# EAGLE design CORS_Front_Panel (EAGLE 9.6.2)
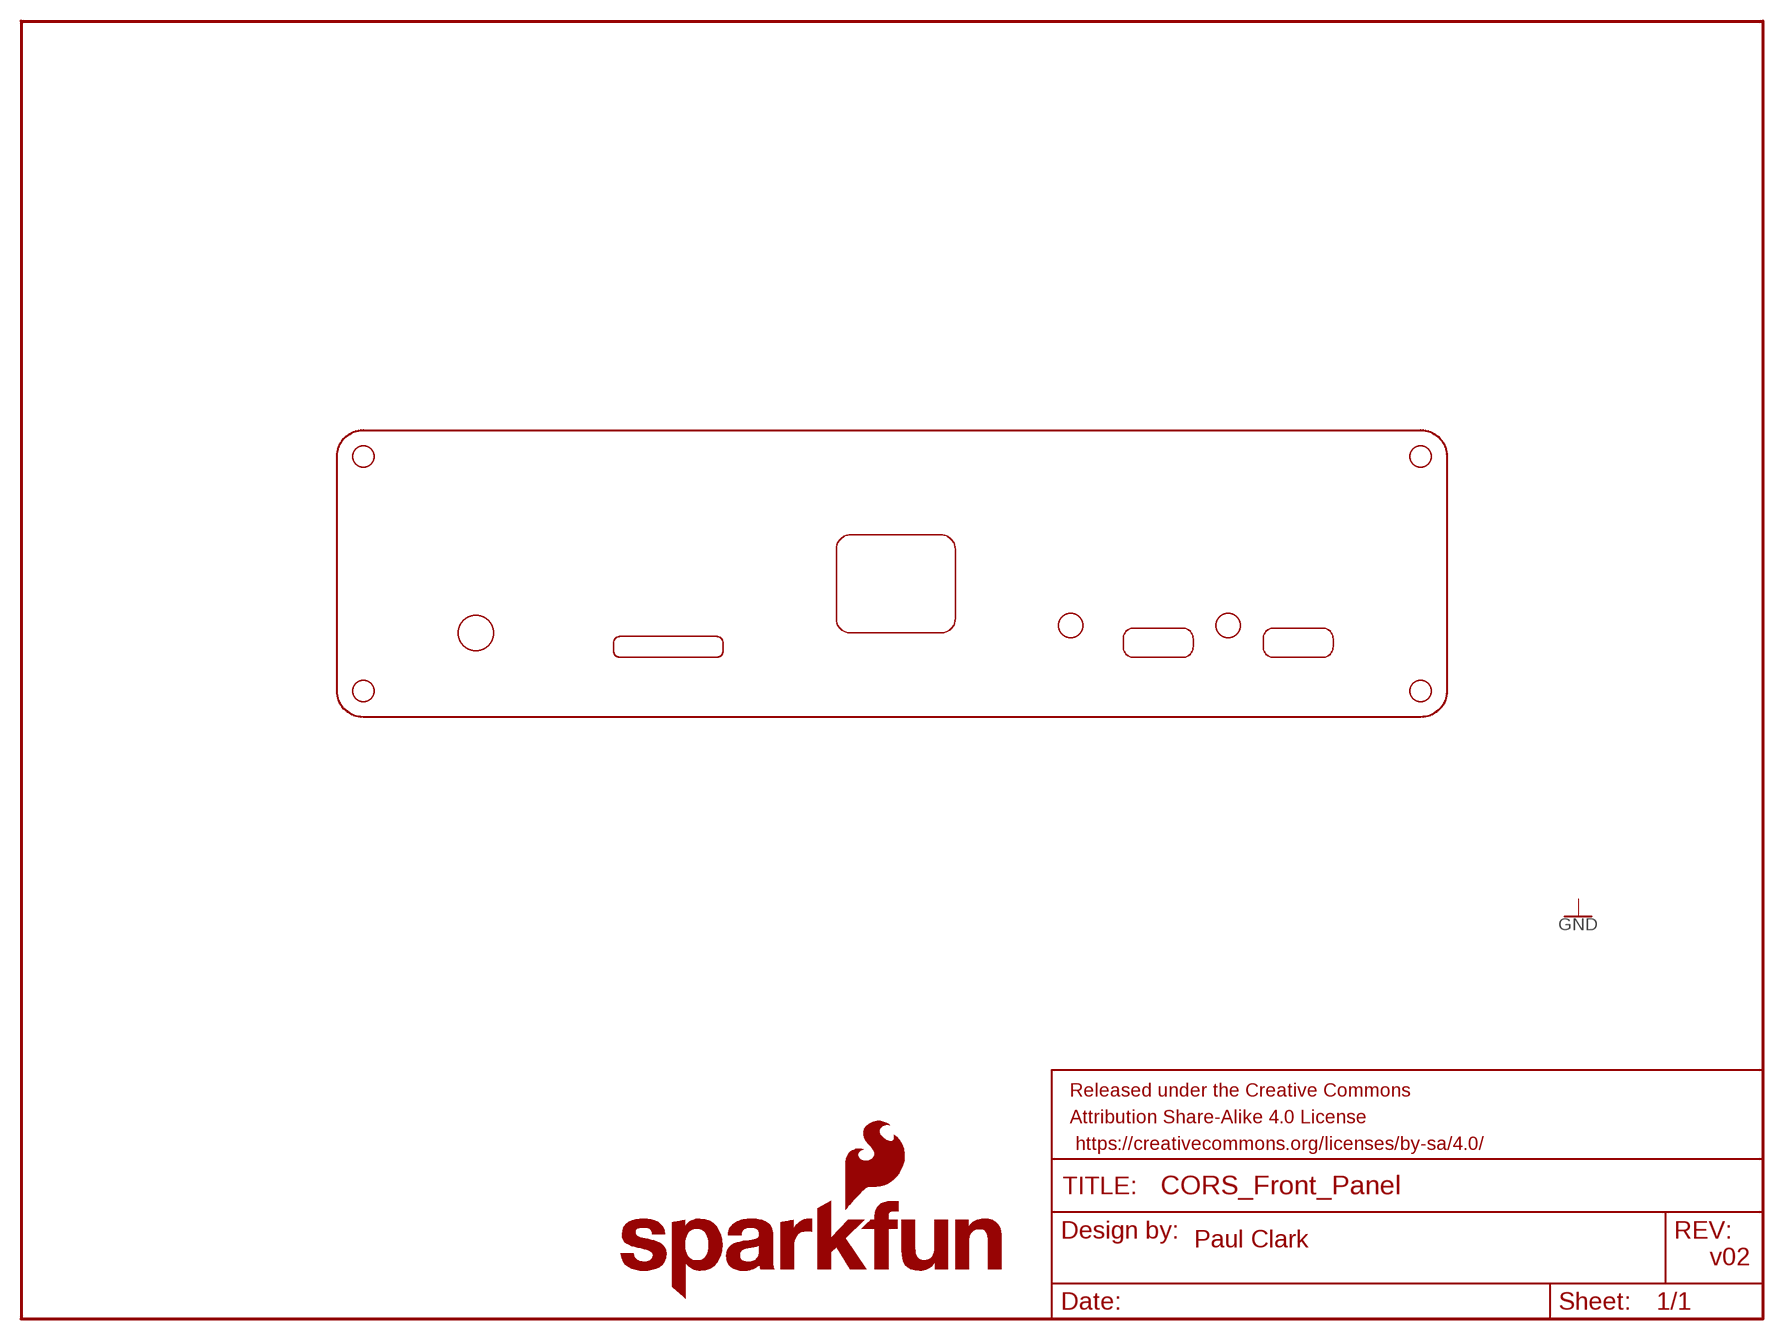
[diagram p0: schematic, sheet 1]

## Parts
BOOT  BUTTON  [BUTTON]
ESP32_USB  USB-C  [USB-C]
FRAME1  FRAME-LETTER  [CREATIVE_COMMONS]
GNSS_USB  USB-C  [USB-C]
LED  LED  [LED]
LOGO1  SFE_LOGO_NAME_FLAME.3_INCH  [SFE_LOGO_NAME_FLAME_.3]
MICRO_SD  MICRO_SD  [MICRO_SD]
OLED  OLED  [OLED]
PANEL_OUTLINE  PANEL_OUTLINE  [PANEL_OUTLINE]
RESET  BUTTON  [BUTTON]

## Notes on the sheet
- Paul Clark
- v02

## Library data of the parts
BOOT RESET = CORS_Panels:BUTTON
ESP32_USB GNSS_USB = CORS_Panels:USB-C
FRAME1 = SparkFun-Aesthetics:FRAME-LETTER: Schematic Frame - Letter Standard 8.5x11 US Letter frame
LED = CORS_Panels:LED
LOGO1 = SparkFun-Aesthetics:SFE_LOGO_NAME_FLAME: SparkFun Font Logo w/ Flame This is the SparkFun full logo. The logo on the schematic will always be the same size; the package variant is the height of the flame part of the logo. Default layer for the logo on the board is tSilk.
MICRO_SD = CORS_Panels:MICRO_SD
OLED = CORS_Panels:OLED
PANEL_OUTLINE = CORS_Panels:PANEL_OUTLINE: Panel Outline Centered on the top surface of the PCB

## Board
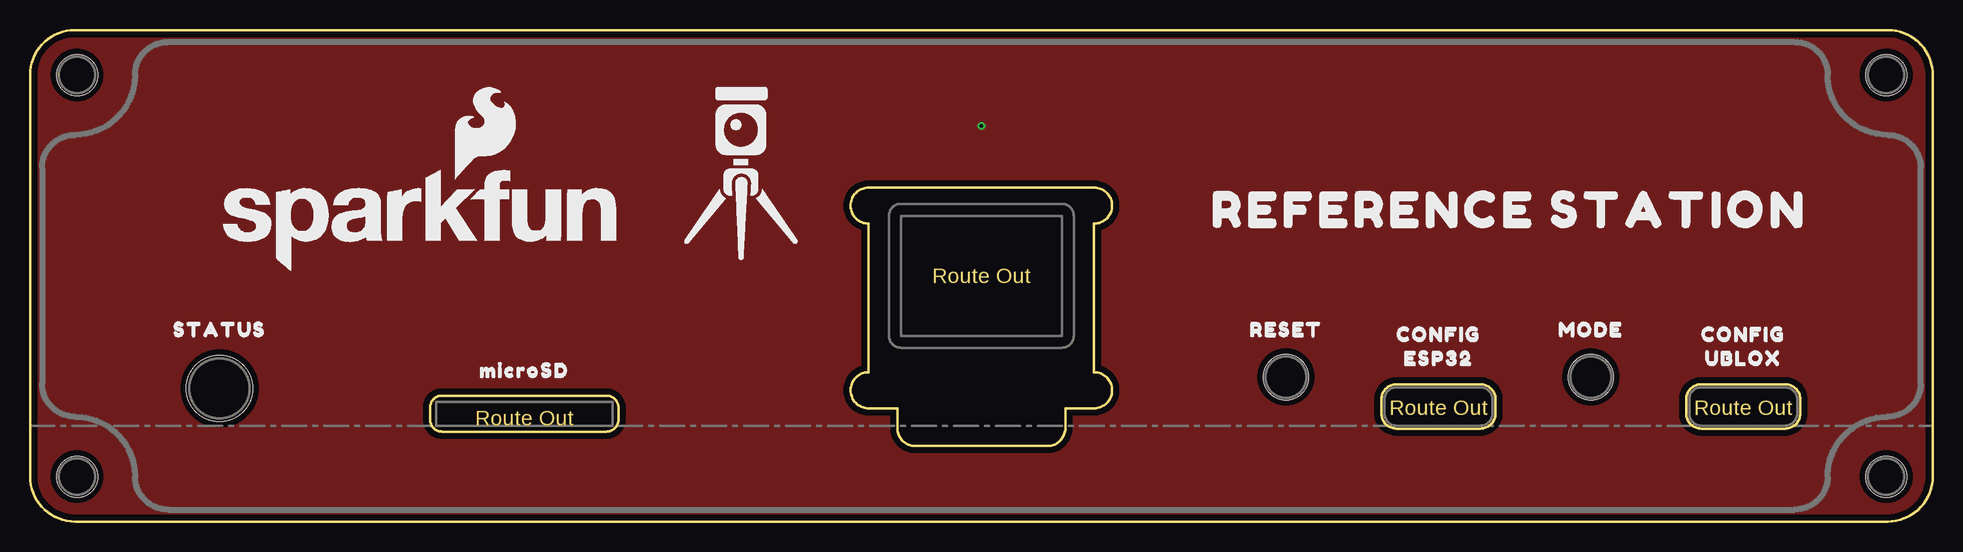
[diagram p1: board, top side]
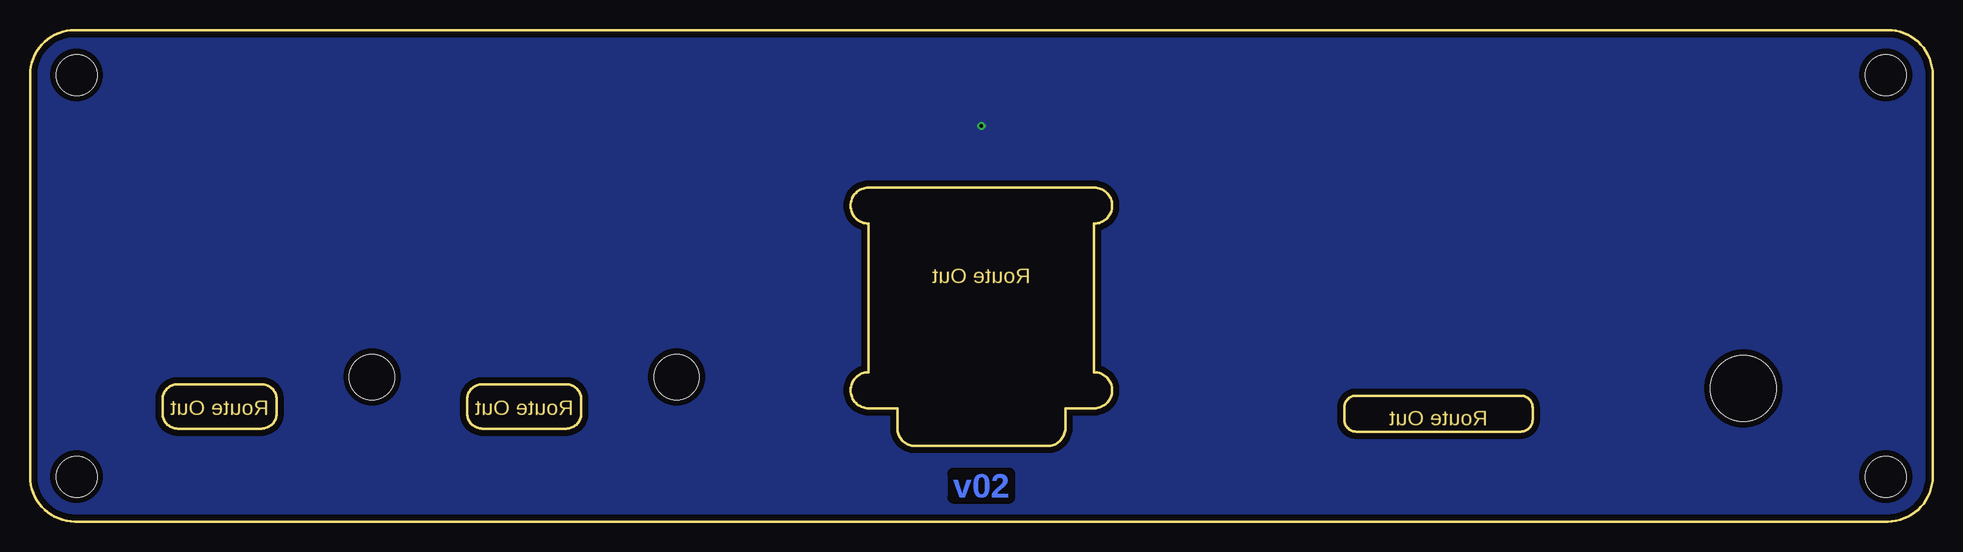
[diagram p2: board, bottom side, seen from below]

Size 158.6 x 41 mm. Coordinates in mm from the lower left corner, seen from the top.
Outline: 0,3.75 arc90 3.75,0 154.85,0 arc90 158.6,3.75 158.6,37.25 arc90 154.85,41 3.75,41 arc90 0,37.25 0,3.75
Copper layers (1*16): Top 0.035mm / dielectric 1.5mm / Bottom 0.035mm
Design rules "SparkFun-2-Layer-General-JLCPCB": minimum track width 7mil, minimum drill 0.3mm, track to track 7mil, track to pad 7mil, pad to pad 7mil, via to via 7mil, smd to smd 7mil, copper to edge 7mil, drill to drill 7mil, minimum pad ring 7mil, minimum via ring 7mil, stop-mask expansion 3mil, vias tented up to drill 25mil, thermal gap 10mil

### Footprints (pad centres in the part's own frame; a part is rotated, then mirrored left to right if it is on the bottom)
BUTTON = hole 3.75: 0,4.05
LED = hole 5.5: 0,3.1
PANEL_OUTLINE = hole 3.4: -75.4,29.25; 75.4,29.25; 75.4,-4.25; -75.4,-4.25

### Placement (x,y rotation side)
BOOT  130.1,8 0 top
ESP32_USB  117.4,8 0 top
FRAME1  60.25,-16.13 0 top  (outside the outline)
GNSS_USB  142.8,8 0 top
LED  15.8,8 0 top
LOGO1  32.45,25.09 0 top
MICRO_SD  41.2,8 0 top
OLED  79.3,20.5 0 top
PANEL_OUTLINE  79.32,8 0 top
RESET  104.7,8 0 top
STATUS  [STATUS0]  15.8,16 0 top
U$1  [REFERENCE_STATION0]  123.3,26 0 top
U$2  [MODE0]  130.1,16 0 top
U$7  [MICROSD1]  41.2,12.6 0 top
U$8  [RESET2]  104.7,16 0 top
U$9  [CONFIG3]  117.4,15.6 0 top
U$10  [CONFIG3]  142.8,15.6 0 top
U$11  [ESP324]  117.4,13.6 0 top
U$13  [UBLOX326]  142.8,13.6 0 top

### Tracks (layer width: path | path; a pad name or v marks a point on that pad's centre or on a via)
GND  (via drill 0.3)
  other vias: 79.3,33
  pour Top (isolate 0.5, no thermals): 0,41 158.6,41 158.6,0 0,0
  pour Bottom (isolate 0.5, no thermals): 0,41 158.6,41 158.6,0 0,0

### Text on the board
Bottom: v02
tDocu: Paul Clark